# Altium schematic sheet connect.SchDoc
size A4
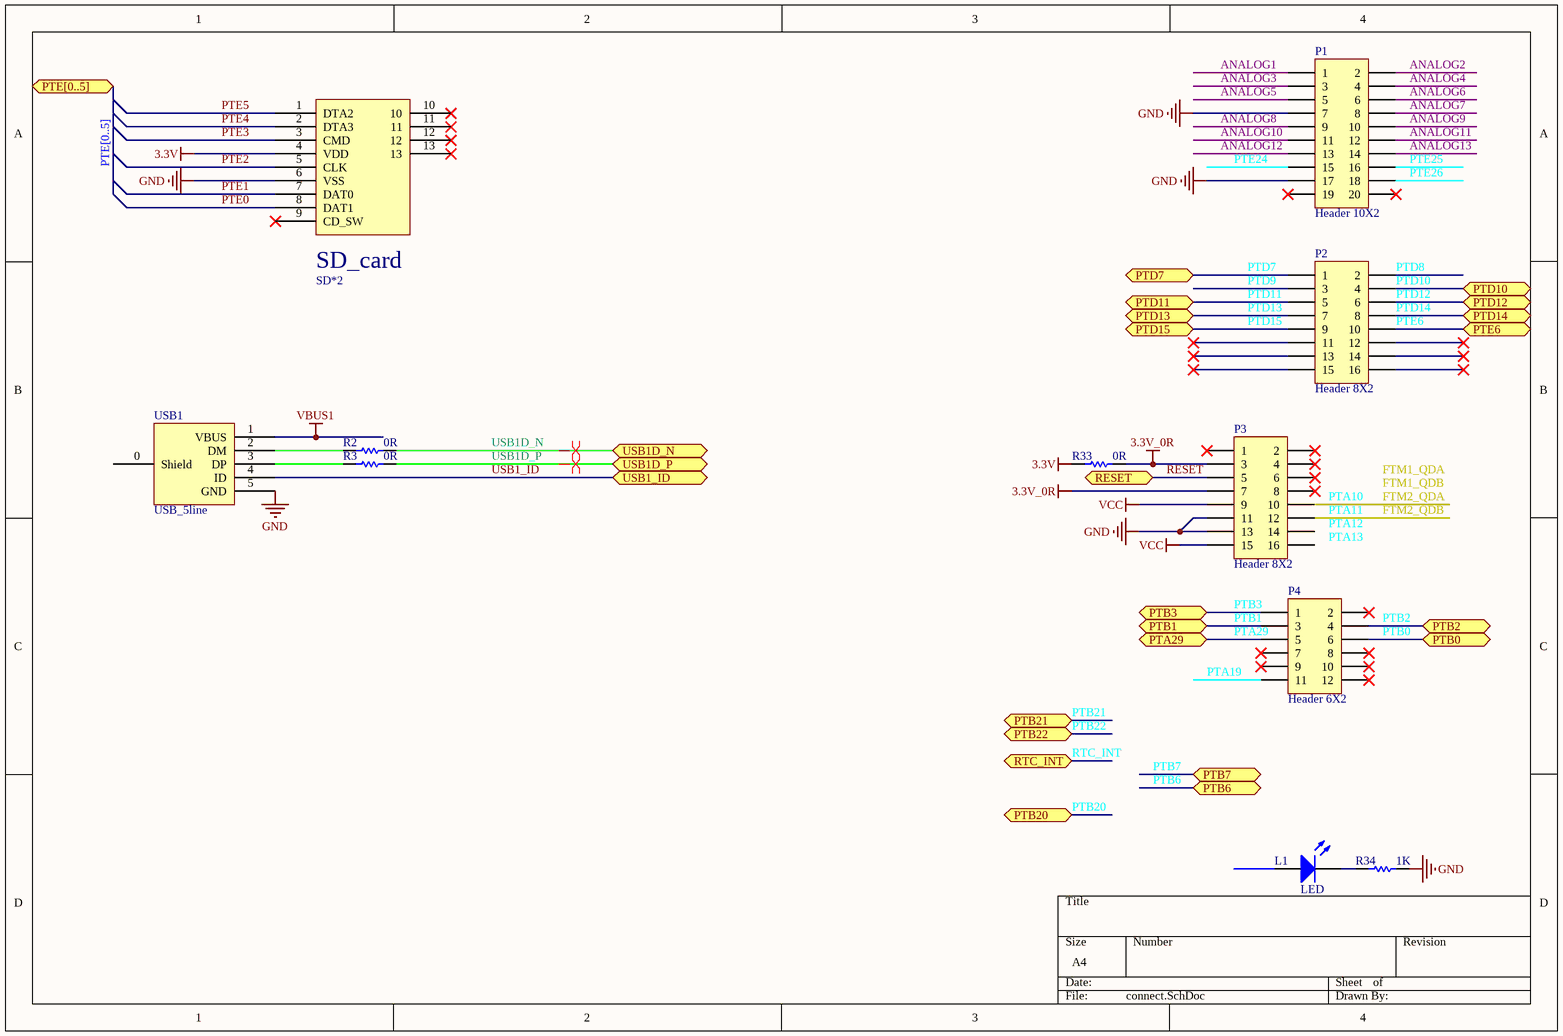
[diagram p0: connect.SchDoc]

## Parts
L1  LED  [1608[0603]]
P1  Header 10X2  [HDR2X10]
P2  Header 8X2  [HDR2X8]
P3  Header 8X2  [HDR2X8]
P4  Header 6X2  [HDR2X6]
R2  value 0R  [1608[0603]]  (hidden comment: Res)
R3  value 0R  [1608[0603]]  (hidden comment: Res)
R33  value 0R  [1206]  (hidden comment: Res)
R34  value 1K  [1608[0603]]  (hidden comment: Res)
SD*2  TF_card  [TF卡座(短体)]  (value not drawn)
USB1  USB_5line  [USB-MICRO-5P-2F]

## Ports
PTA29, PTB0, PTB1, PTB2, PTB3, PTB6, PTB7, PTB20, PTB21, PTB22, PTD7, PTD10, PTD11, PTD12, PTD13, PTD14, PTD15, PTE6, PTE[0..5], RESET, RTC_INT, USB1_ID, USB1D_N, USB1D_P

## Nets
3.3V: R33.2 SD*2.4(VDD)
3.3V_0R: P3.3 P3.7 R33.1
GND: P1.7 P1.17 P3.11 P3.13 R34.1 SD*2.6(VSS) USB1.5(GND)
VBUS1: USB1.1(VBUS)
VCC: P3.9 P3.15
ANALOG1: P1.1
ANALOG2: P1.2
ANALOG3: P1.3
ANALOG4: P1.4
ANALOG5: P1.5
ANALOG6: P1.6
ANALOG7: P1.8
ANALOG8: P1.9
ANALOG9: P1.10
ANALOG10: P1.11
ANALOG11: P1.12
ANALOG12: P1.13
ANALOG13: P1.14
FTM2_QDA: P3.10  [also labelled PTA10]
FTM2_QDB: P3.12  [also labelled PTA11]
PTA19: P4.11
PTA29: P4.5 ; port PTA29
PTB0: P4.6 ; port PTB0
PTB1: P4.3 ; port PTB1
PTB2: P4.4 ; port PTB2
PTB3: P4.1 ; port PTB3
PTB6: port PTB6
PTB7: port PTB7
PTB20: port PTB20
PTB21: port PTB21
PTB22: port PTB22
PTD7: P2.1 ; port PTD7
PTD8: P2.2
PTD9: P2.3
PTD10: P2.4 ; port PTD10
PTD11: P2.5 ; port PTD11
PTD12: P2.6 ; port PTD12
PTD13: P2.7 ; port PTD13
PTD14: P2.8 ; port PTD14
PTD15: P2.9 ; port PTD15
PTE0: SD*2.8(DAT1)
PTE1: SD*2.7(DAT0)
PTE2: SD*2.5(CLK)
PTE3: SD*2.3(CMD)
PTE4: SD*2.2(DTA3)
PTE5: SD*2.1(DTA2)
PTE6: P2.10 ; port PTE6
PTE24: P1.15
PTE25: P1.16
PTE26: P1.18
RESET: P3.5 ; port RESET
RTC_INT: port RTC_INT
USB1_ID: USB1.4(ID) ; port USB1_ID
USB1D_N: R2.1 ; port USB1D_N
USB1D_P: R3.1 ; port USB1D_P
NetL1_2: L1.2(K) R34.2
NetR2_2: R2.2 USB1.2(DM)
NetR3_2: R3.2 USB1.3(DP)

Not connected (* = marked no-connect by the designer): L1 1(A); P1 19* 20*; P2 11* 12* 13* 14* 15* 16*; P3 1* 2* 4* 6* 8* 14 16; P4 2* 7* 8* 9* 10* 12*; SD*2 9(CD_SW)* 10* 11* 12* 13*; USB1 0(Shield)

## Buses and harness runs
bus PTE[0..5] = port PTE[0..5]

## Layout directives
differential pair: USB1D_N, USB1D_P

## Notes on the sheet
- Labels drawn without touching a wire or pin: FTM1_QDA, FTM1_QDB, PTA12, PTA13
- (in symbol TF_card) SD_card

## Library data of the parts
P1 = Header 10X2: Header, 10-Pin, Dual row; LatestRevisionDate: 17-Jul-2002; LatestRevisionNote: Re-released for DXP Platform.; Publisher: Altium Limited
P2 P3 = Header 8X2: Header, 8-Pin, Dual row; LatestRevisionDate: 17-Jul-2002; LatestRevisionNote: Re-released for DXP Platform.; Publisher: Altium Limited
P4 = Header 6X2: Header, 6-Pin, Dual row; LatestRevisionDate: 17-Jul-2002; LatestRevisionNote: Re-released for DXP Platform.; Publisher: Altium Limited
R2 R3 R33 R34 = Res: 贴片电阻; Published: 8-Jun-2000; LatestRevisionDate: 17-Jul-2002; LatestRevisionNote: Re-released for DXP Platform.; PackageReference: AXIAL-0.3; Publisher: Altium Limited